# EAGLE schematic dc26_maneki-neko_badge_page01_20180626 (EAGLE 9.0.1)
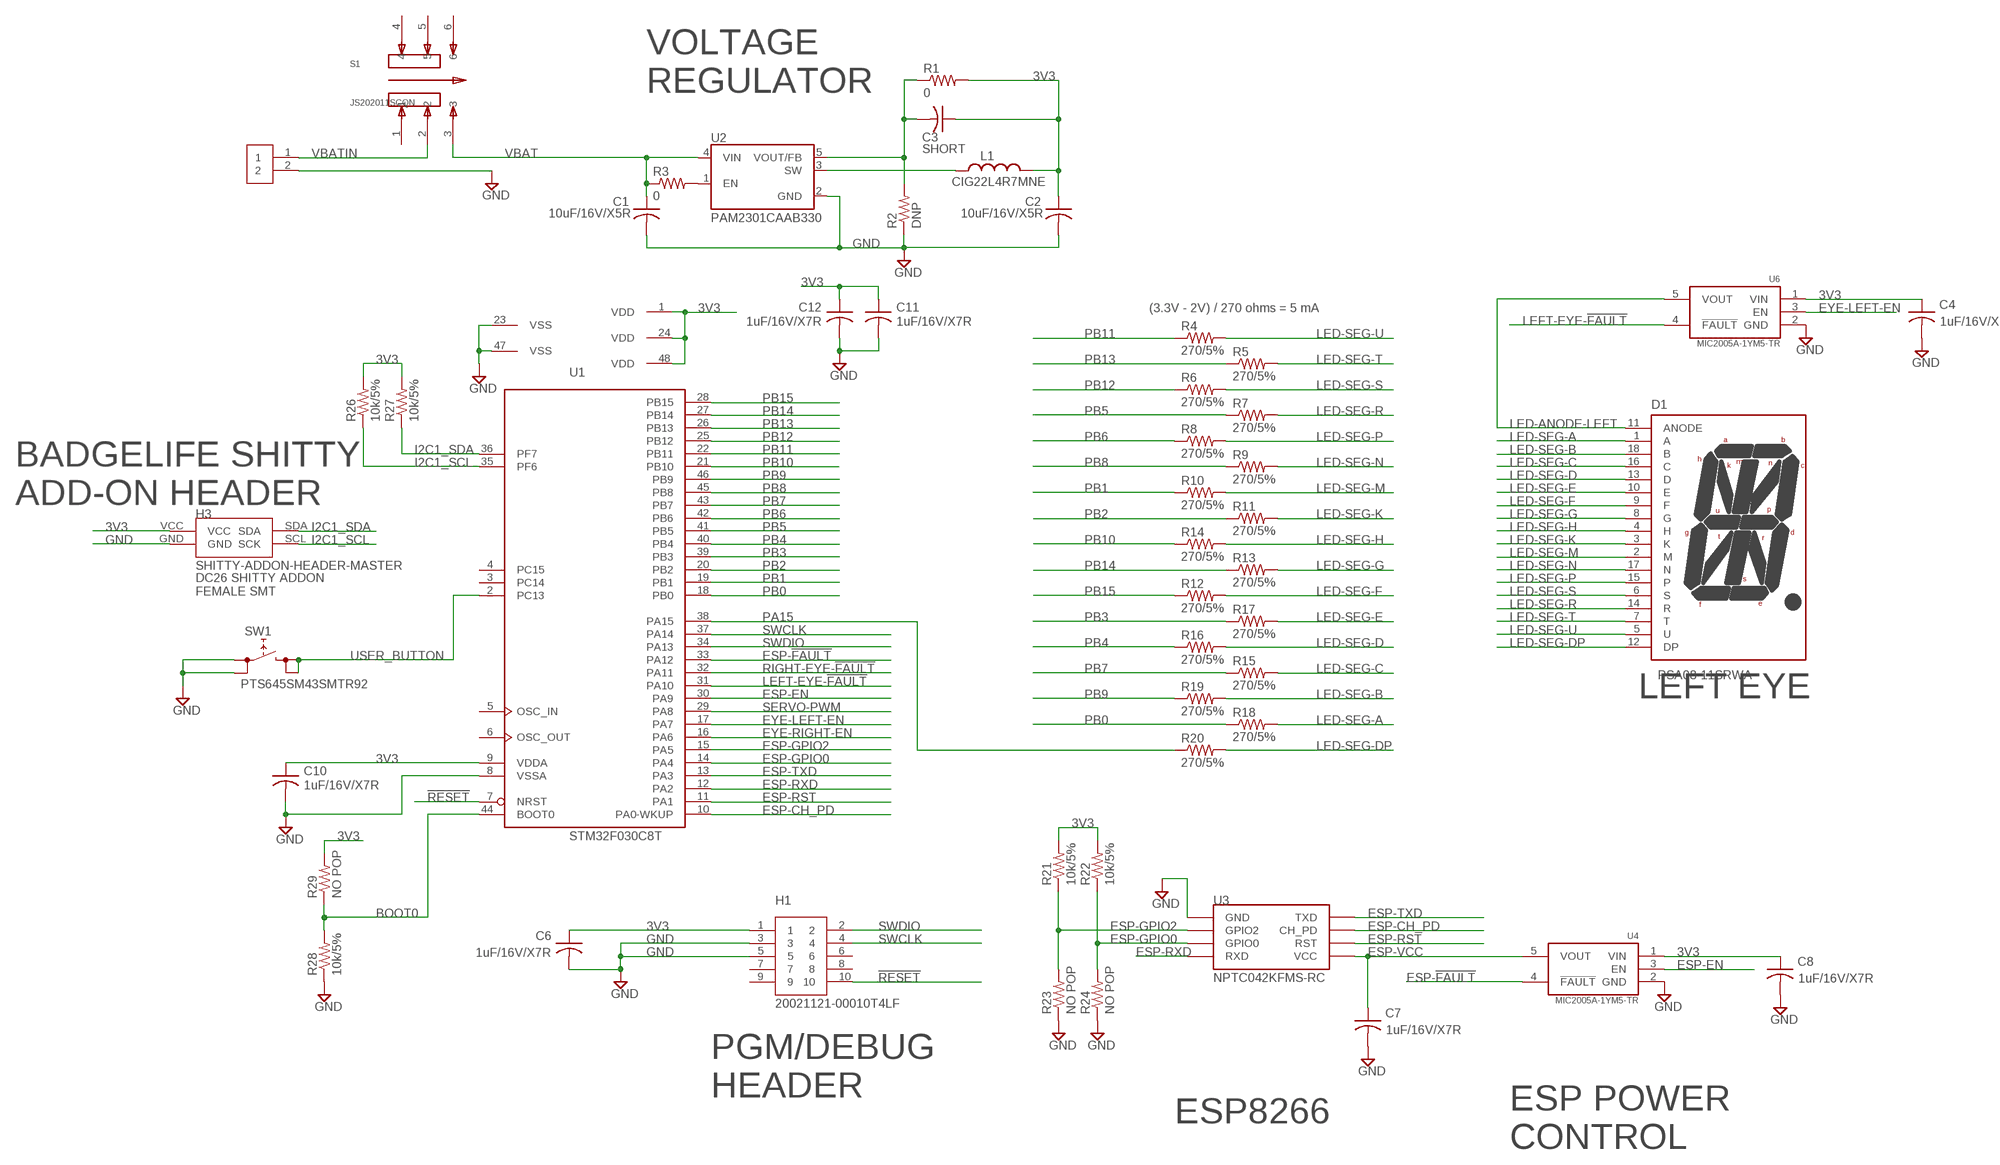
[diagram p0: schematic, sheet 1, part 1 of 2]
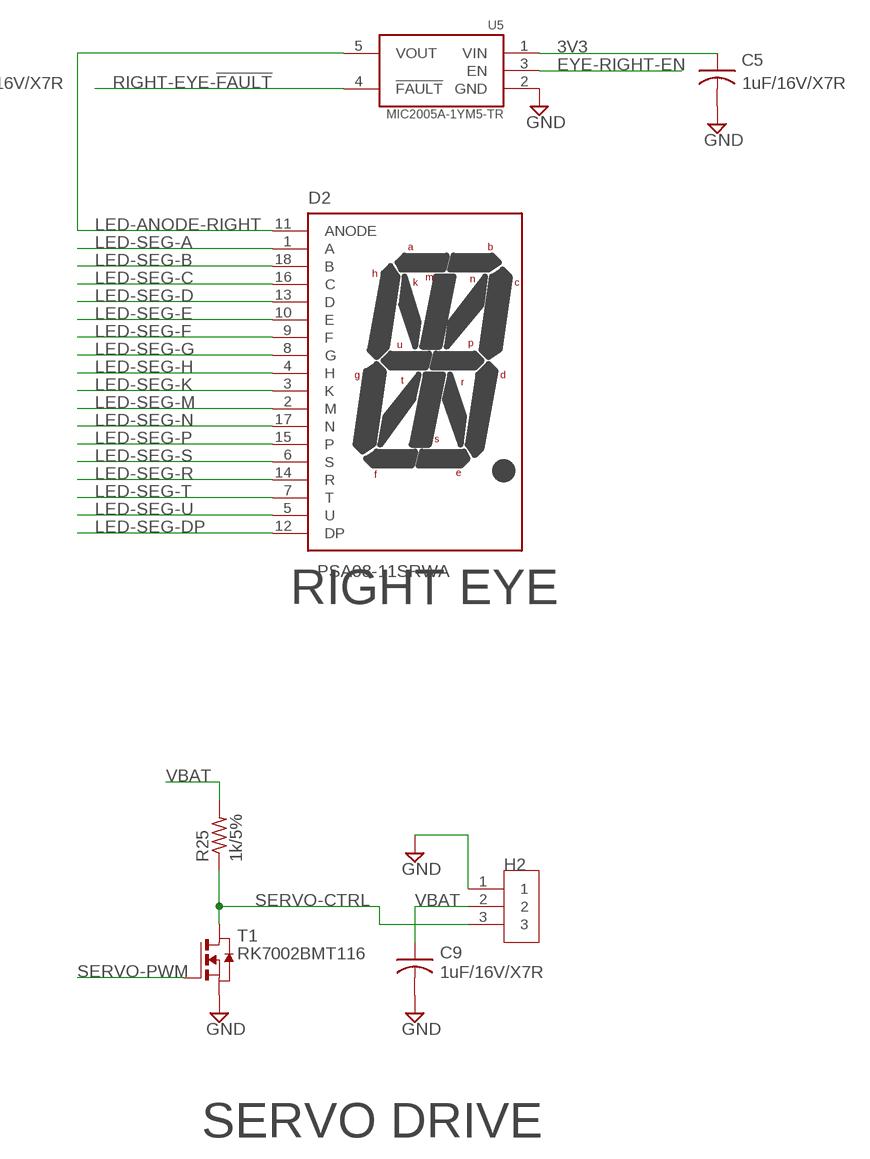
[diagram p1: schematic, sheet 1, part 2 of 2]

## Parts
C1  10uF/16V/X5R  C-USC0805  [C0805]
C2  10uF/16V/X5R  C-USC0805  [C0805]
C3  SHORT  C-USC0805  [C0805]
C4  1uF/16V/X7R  C-USC0805  [C0805]
C5  1uF/16V/X7R  C-USC0805  [C0805]
C6  1uF/16V/X7R  C-USC0805  [C0805]
C7  1uF/16V/X7R  C-USC0805  [C0805]
C8  1uF/16V/X7R  C-USC0805  [C0805]
C9  1uF/16V/X7R  C-USC0805  [C0805]
C10  1uF/16V/X7R  C-USC0805  [C0805]
C11  1uF/16V/X7R  C-USC0805  [C0805]
C12  1uF/16V/X7R  C-USC0805  [C0805]
D1  PSA08-11SRWA  [PSA08-11SRWA]
D2  PSA08-11SRWA  [PSA08-11SRWA]
H1  20021121-00010T4LF  [20021121-00010T4LF]
H2  M20-8890345R  [M20-8890345R]
H3  SHITTY-ADDON-HEADER-MASTER  [2X2-0.1INCH-FEMALE-SMT]
L1  CIG22L4R7MNE  [L-1008-US]
R1  0  R-US_R0805  [R0805]
R2  DNP  R-US_R0805  [R0805]
R3  0  R-US_R0805  [R0805]
R4  270/5%  R-US_R0805  [R0805]
R5  270/5%  R-US_R0805  [R0805]
R6  270/5%  R-US_R0805  [R0805]
R7  270/5%  R-US_R0805  [R0805]
R8  270/5%  R-US_R0805  [R0805]
R9  270/5%  R-US_R0805  [R0805]
R10  270/5%  R-US_R0805  [R0805]
R11  270/5%  R-US_R0805  [R0805]
R12  270/5%  R-US_R0805  [R0805]
R13  270/5%  R-US_R0805  [R0805]
R14  270/5%  R-US_R0805  [R0805]
R15  270/5%  R-US_R0805  [R0805]
R16  270/5%  R-US_R0805  [R0805]
R17  270/5%  R-US_R0805  [R0805]
R18  270/5%  R-US_R0805  [R0805]
R19  270/5%  R-US_R0805  [R0805]
R20  270/5%  R-US_R0805  [R0805]
R21  10k/5%  R-US_R0805  [R0805]
R22  10k/5%  R-US_R0805  [R0805]
R23  NO POP  R-US_R0805  [R0805]
R24  NO POP  R-US_R0805  [R0805]
R25  1k/5%  R-US_R0805  [R0805]
R26  10k/5%  R-US_R0805  [R0805]
R27  10k/5%  R-US_R0805  [R0805]
R28  10k/5%  R-US_R0805  [R0805]
R29  NO POP  R-US_R0805  [R0805]
S1  JS202011SCQN  [SW_JS202011SCQN]
SW1  PTS645SM43SMTR92  [PTS645SM43SMTR92]
T1  RK7002BMT116  NMOSSOT23  [SOT-23]
U1  STM32F030C8T  [LQFP48]
U2  PAM2301CAAB330  [SOT95P280X100-5N]
U3  NPTC042KFMS-RC  [NPTC042KFMS-RC]
U4  MIC2005A-1YM5-TR  [SOT95P270X145-5N]
U5  MIC2005A-1YM5-TR  [SOT95P270X145-5N]
U6  MIC2005A-1YM5-TR  [SOT95P270X145-5N]
U$2  BATTPADS-SMT  [BATTPADS-SMT]

## Nets
3V3: C2.1 C3.1 C4.1 C5.1 C6.1 C8.1 C10.1 C11.1 C12.1 H1.1 H3.VCC L1.P$2 R1.2 R21.2 R22.2 R26.2 R27.2 R29.2 U1.1(VDD) U1.9(VDDA) U1.24(VDD) U1.48(VDD) U4.1(VIN) U5.1(VIN) U6.1(VIN)
!RESET: H1.10 U1.7(NRST)
BOOT0: R28.2 R29.1 U1.44(BOOT0)
ESP-!FAULT: U1.33(PA12) U4.4(!FAULT)
ESP-CH_PD: U1.10(PA0-WKUP) U3.3(CH_PD)
ESP-EN: U1.30(PA9) U4.3(EN)
ESP-GPIO0: R22.1 R24.2 U1.14(PA4) U3.6(GPIO0)
ESP-GPIO2: R21.1 R23.2 U1.15(PA5) U3.4(GPIO2)
ESP-RST: U1.11(PA1) U3.5(RST)
ESP-RXD: U1.12(PA2) U3.8(RXD)
ESP-TXD: U1.13(PA3) U3.1(TXD)
ESP-VCC: C7.1 U3.7(VCC) U4.5(VOUT)
EYE-LEFT-EN: U1.17(PA7) U6.3(EN)
EYE-RIGHT-EN: U1.16(PA6) U5.3(EN)
GND: C1.2 C2.2 C4.2 C5.2 C6.2 C7.2 C8.2 C9.2 C10.2 C11.2 C12.2 H1.3 H1.5 H2.1 H3.GND R2.1 R23.1 R24.1 R28.1 SW1.1 SW1.2 T1.2(S) U1.8(VSSA) U1.23(VSS) U1.47(VSS) U2.2(GND) U3.2(GND) U4.2(GND) U5.2(GND) U6.2(GND) U$2.2
I2C1_SCL: H3.SCL(SCK) R26.1 U1.35(PF6)
I2C1_SDA: H3.SDA R27.1 U1.36(PF7)
LED-ANODE-LEFT: D1.11(ANODE) U6.5(VOUT)
LED-ANODE-RIGHT: D2.11(ANODE) U5.5(VOUT)
LED-SEG-A: D1.1(A) D2.1(A) R18.2
LED-SEG-B: D1.18(B) D2.18(B) R19.2
LED-SEG-C: D1.16(C) D2.16(C) R15.2
LED-SEG-D: D1.13(D) D2.13(D) R16.2
LED-SEG-DP: D1.12(DP) D2.12(DP) R20.2
LED-SEG-E: D1.10(E) D2.10(E) R17.2
LED-SEG-F: D1.9(F) D2.9(F) R12.2
LED-SEG-G: D1.8(G) D2.8(G) R13.2
LED-SEG-H: D1.4(H) D2.4(H) R14.2
LED-SEG-K: D1.3(K) D2.3(K) R11.2
LED-SEG-M: D1.2(M) D2.2(M) R10.2
LED-SEG-N: D1.17(N) D2.17(N) R9.2
LED-SEG-P: D1.15(P) D2.15(P) R8.2
LED-SEG-R: D1.14(R) D2.14(R) R7.2
LED-SEG-S: D1.6(S) D2.6(S) R6.2
LED-SEG-T: D1.7(T) D2.7(T) R5.2
LED-SEG-U: D1.5(U) D2.5(U) R4.2
LEFT-EYE-!FAULT: U1.31(PA10) U6.4(!FAULT)
N$1: L1.P$1 U2.3(SW)
N$2: R3.2 U2.1(EN)
N$3: C3.2 R1.1 R2.2 U2.5(VOUT/FB)
PA15: R20.1 U1.38(PA15)
PB0: R18.1 U1.18(PB0)
PB1: R10.1 U1.19(PB1)
PB2: R11.1 U1.20(PB2)
PB3: R17.1 U1.39(PB3)
PB4: R16.1 U1.40(PB4)
PB5: R7.1 U1.41(PB5)
PB6: R8.1 U1.42(PB6)
PB7: R15.1 U1.43(PB7)
PB8: R9.1 U1.45(PB8)
PB9: R19.1 U1.46(PB9)
PB10: R14.1 U1.21(PB10)
PB11: R4.1 U1.22(PB11)
PB12: R6.1 U1.25(PB12)
PB13: R5.1 U1.26(PB13)
PB14: R13.1 U1.27(PB14)
PB15: R12.1 U1.28(PB15)
RIGHT-EYE-!FAULT: U1.32(PA11) U5.4(!FAULT)
SERVO-CTRL: H2.3 R25.1 T1.1(D)
SERVO-PWM: T1.3(G) U1.29(PA8)
SWCLK: H1.4 U1.37(PA14)
SWDIO: H1.2 U1.34(PA13)
USER_BUTTON: SW1.3 SW1.4 U1.2(PC13)
VBAT: C1.1 C9.1 H2.2 R3.1 R25.2 S1.3 U2.4(VIN)
VBATIN: S1.2 U$2.1
Unconnected: H1.6 H1.7 H1.8 H1.9 S1.1 S1.4 S1.5 S1.6 U1.3(PC14) U1.4(PC15) U1.5(OSC_IN) U1.6(OSC_OUT)

## Notes on the sheet
- VOLTAGE
  REGULATOR
- (3.3V - 2V) / 270 ohms = 5 mA
- BADGELIFE SHITTY
  ADD-ON HEADER
- LEFT EYE | RIGHT EYE
- SERVO DRIVE
- PGM/DEBUG
  HEADER
- ESP8266
- ESP POWER
  CONTROL

## Library data of the parts
C1-C12 = rcl:C-US: CAPACITOR, American symbol; SPICEPREFIX: C
D1 D2 = PSA08-11SRWA:PSA08-11SRWA
H1 = 20021121-00010T4LF:20021121-00010T4LF
H2 = M20-8890345R:M20-8890345R
H3 = dc26-shitty-addon:SHITTY-ADDON-HEADER-MASTER
L1 = passives:CIG22L4R7MNE
R1-R29 = rcl:R-US_: RESISTOR, American symbol; SPICEPREFIX: R
S1 = JS202011SCQN:JS202011SCQN: JS Series DPDT On-On Gull Wing Surface Mount Subminiature Slide Switch; AVAILABILITY: Good; DESCRIPTION: JS Series DPDT On-On Gull Wing Surface Mount Subminiature Slide Switch; MF: C&K Components; MP: JS202011SCQN; PACKAGE: None; PRICE: 0.33 USD
SW1 = PTS645SM43SMTR92:PTS645SM43SMTR92
T1 = zetex:NMOSSOT23: MOS FET; OC_FARNELL: unknown; OC_NEWARK: unknown
U1 = micro-stm_v3:STM32F030C*T: ARM 32-bit Cortex™-M0 CPU 48 MHz maximum frequency 32 to 64 Kbytes of Flash memory 4 to 8 kbytes of SRAM 39 GPIOs 2.4 to 3.6 V application supply
U2 = PAM2301CAAB120:PAM2301CAAB330
U3 = NPTC042KFMS-RC:NPTC042KFMS-RC
U4-U6 = MIC2005A-1YM5-TR:MIC2005A-1YM5-TR
U$2 = battery_pads:BATTPADS-SMT